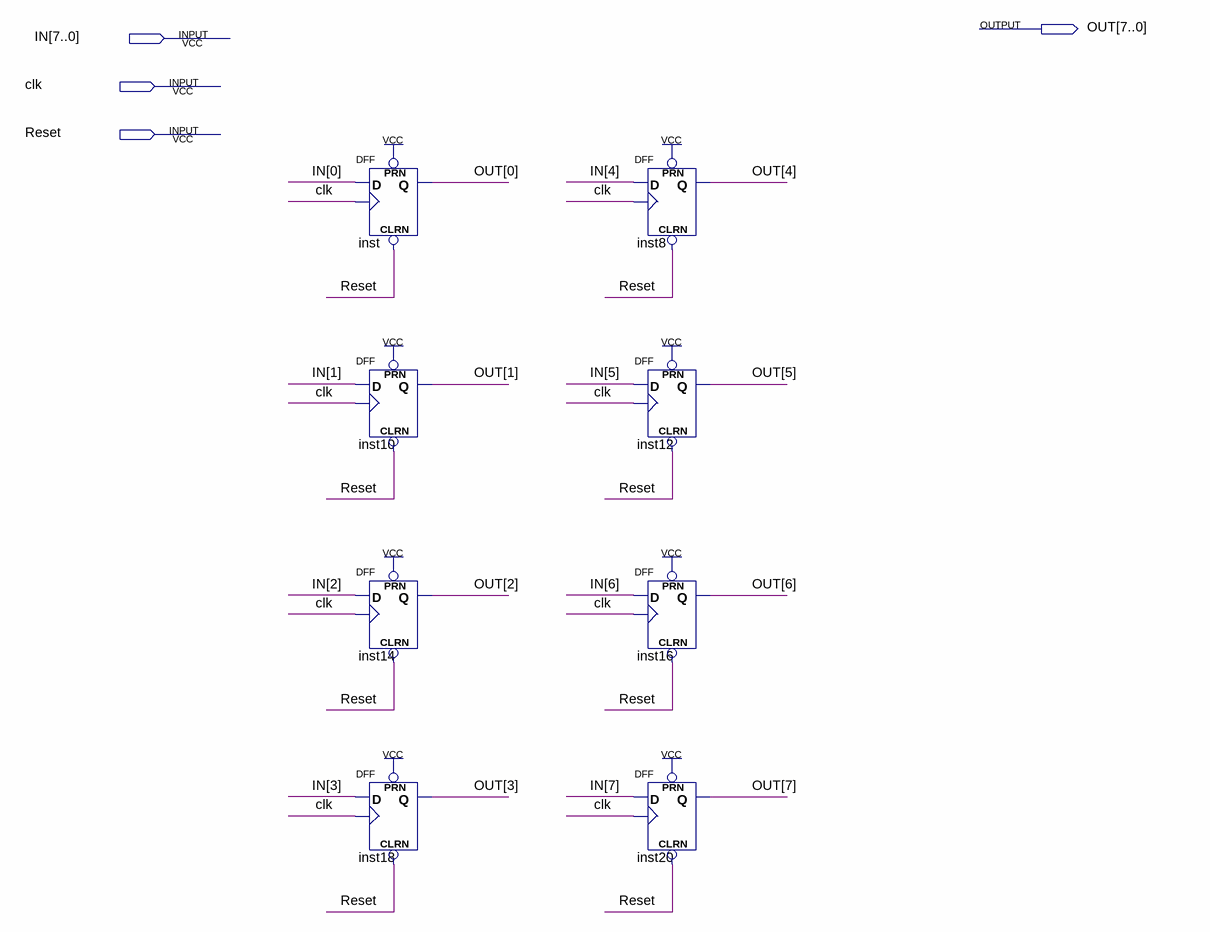
[diagram p0: schematic sheet]
// Quartus schematic REGISTER.bdf as structural Verilog: 8 symbols, 4 pins
module REGISTER (
  input  [7:0] IN,
  input  clk,
  input  Reset,
  output [7:0] OUT
);

  DFF inst (.CLRN(Reset), .CLK(clk), .D(IN[0]), .PRN(1'b1), .Q(OUT[0]));
  DFF inst10 (.CLRN(Reset), .CLK(clk), .D(IN[1]), .PRN(1'b1), .Q(OUT[1]));
  DFF inst14 (.CLRN(Reset), .CLK(clk), .D(IN[2]), .PRN(1'b1), .Q(OUT[2]));
  DFF inst18 (.CLRN(Reset), .CLK(clk), .D(IN[3]), .PRN(1'b1), .Q(OUT[3]));
  DFF inst8 (.CLRN(Reset), .CLK(clk), .D(IN[4]), .PRN(1'b1), .Q(OUT[4]));
  DFF inst12 (.CLRN(Reset), .CLK(clk), .D(IN[5]), .PRN(1'b1), .Q(OUT[5]));
  DFF inst16 (.CLRN(Reset), .CLK(clk), .D(IN[6]), .PRN(1'b1), .Q(OUT[6]));
  DFF inst20 (.CLRN(Reset), .CLK(clk), .D(IN[7]), .PRN(1'b1), .Q(OUT[7]));
endmodule
